# Altium schematic sheet CLOCK.SchDoc: GPS CLOCK
size A4; Date: 2022/9/30; Author: EUCLID; DrawnBy: EUCLID; Revision: @V1.0; SheetNumber: 1; SheetTotal: 1; Time: 11:24
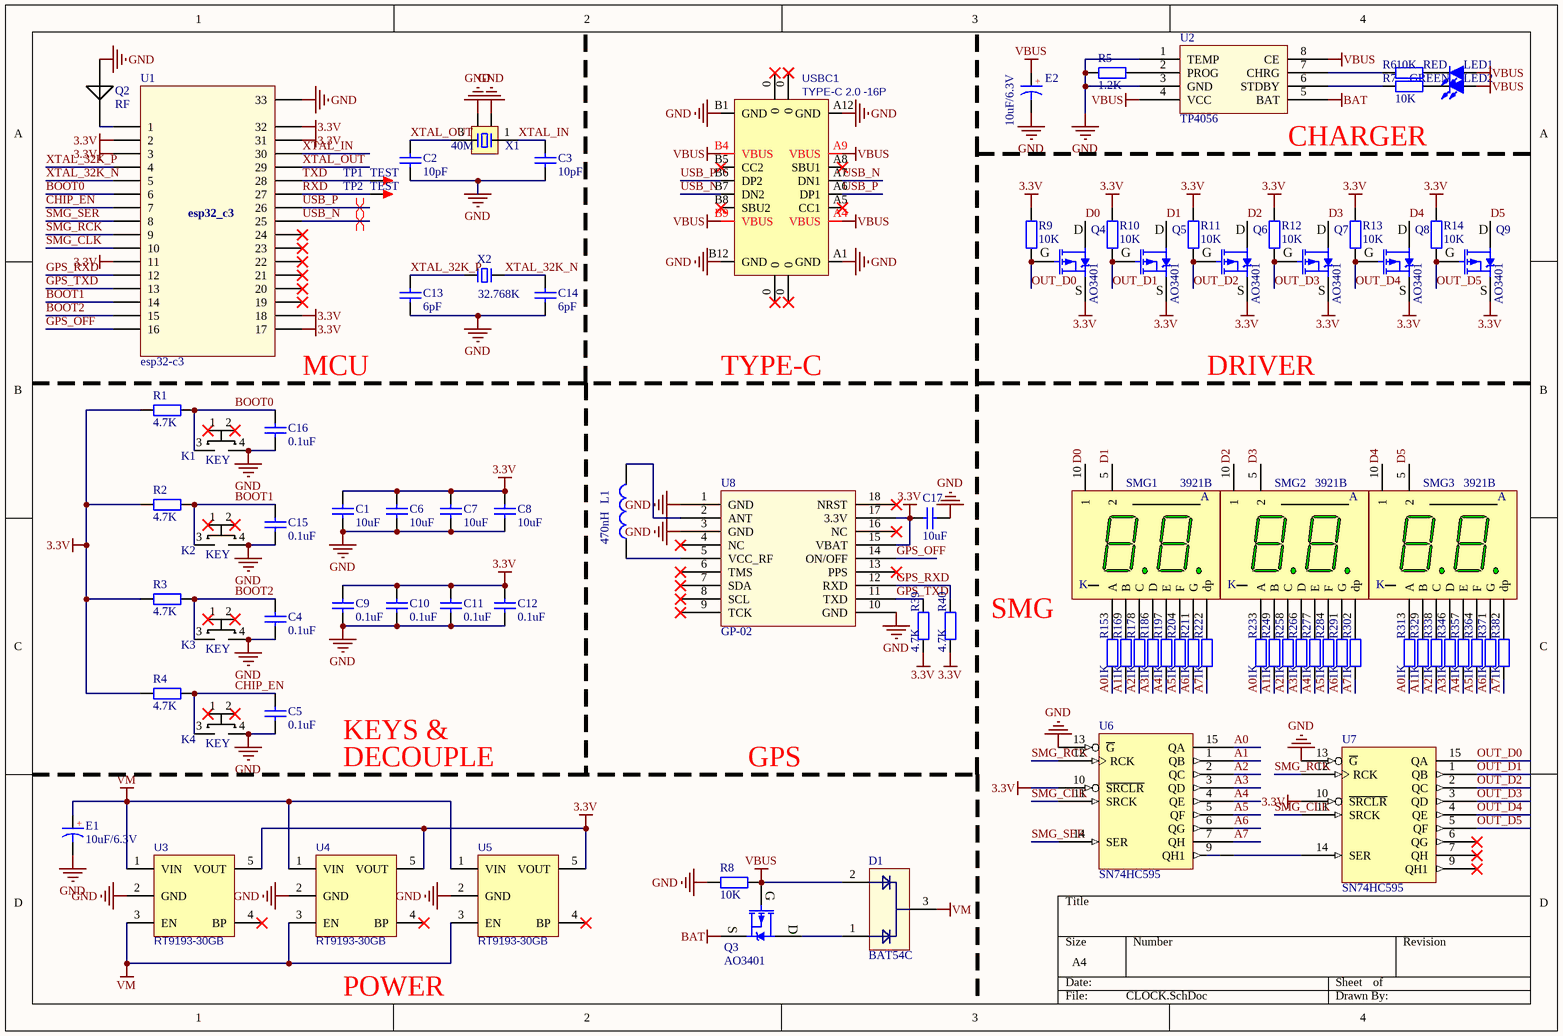
[diagram p0: CLOCK.SchDoc]

## Parts
C1  10uF  [C0603_L]
C2  10pF  [C0603_L]
C3  10pF  [C0603_L]
C4  0.1uF  [C0603_L]
C5  0.1uF  [C0603_L]
C6  10uF  [C0603_L]
C7  10uF  [C0603_L]
C8  10uF  [C0603_L]
C9  0.1uF  [C0603_L]
C10  0.1uF  [C0603_L]
C11  0.1uF  [C0603_L]
C12  0.1uF  [C0603_L]
C13  6pF  [C0603_L]
C14  6pF  [C0603_L]
C15  0.1uF  [C0603_L]
C16  0.1uF  [C0603_L]
C17  10uF  [C0603_L]
D1  BAT54C  [SOT23-3N]
E1  10uF/6.3V  [C_2012]
E2  10uF/6.3V  [C_2012]
K1  KEY  [KEY]
K2  KEY  [KEY]
K3  KEY  [KEY]
K4  KEY  [KEY]
L1  470nH  [L0603]
LED1  RED  [LED0805_G]
LED2  GREEN  [LED0805_G]
Q2  RF  [RF]
Q3  AO3401  [SOT23-3N]
Q4  AO3401  [SOT23-3N]
Q5  AO3401  [SOT23-3N]
Q6  AO3401  [SOT23-3N]
Q7  AO3401  [SOT23-3N]
Q8  AO3401  [SOT23-3N]
Q9  AO3401  [SOT23-3N]
R1  4.7K  [R0603_L]
R2  4.7K  [R0603_L]
R3  4.7K  [R0603_L]
R4  4.7K  [R0603_L]
R5  1.2K  [R0603_L]
R6  10K  [R0603_L]
R7  10K  [R0603_L]
R8  10K  [R0603_L]
R9  10K  [R0603_L]
R10  10K  [R0603_L]
R11  10K  [R0603_L]
R12  10K  [R0603_L]
R13  10K  [R0603_L]
R14  10K  [R0603_L]
R15  1K  [R0603_L]
R16  1K  [R0603_L]
R17  1K  [R0603_L]
R18  1K  [R0603_L]
R19  1K  [R0603_L]
R20  1K  [R0603_L]
R21  1K  [R0603_L]
R22  1K  [R0603_L]
R23  1K  [R0603_L]
R24  1K  [R0603_L]
R25  1K  [R0603_L]
R26  1K  [R0603_L]
R27  1K  [R0603_L]
R28  1K  [R0603_L]
R29  1K  [R0603_L]
R30  1K  [R0603_L]
R31  1K  [R0603_L]
R32  1K  [R0603_L]
R33  1K  [R0603_L]
R34  1K  [R0603_L]
R35  1K  [R0603_L]
R36  1K  [R0603_L]
R37  1K  [R0603_L]
R38  1K  [R0603_L]
R39  4.7K  [R0603_L]
R40  4.7K  [R0603_L]
SMG1  3921B  [GS3922CPG-G]
SMG2  3921B  [GS3922CPG-G]
SMG3  3921B  [GS3922CPG-G]
TP1  TEST  [TEST 1.6]
TP2  TEST  [TEST 1.6]
U1  esp32-c3  [QFN32 5x5_M]
U2  TP4056  [SOP-8]
U3  RT9193-30GB  [SOT-23-5]
U4  RT9193-30GB  [SOT-23-5]
U5  RT9193-30GB  [SOT-23-5]
U6  SN74HC595  [SO16]
U7  SN74HC595  [SO16]
U8  GP-02  [GP-02]
USBC1  TYPE-C 2.0 -16P  [USB-C-SMD_16P]
X1  40M  [XTAL-3225-4P]
X2  32.768K  [XTAL-3x8-WS]

## Nets
3.3V: C1.2 C6.2 C7.2 C8.2 C9.2 C10.2 C11.2 C12.2 C17.2 Q4.2(S) Q5.2(S) Q6.2(S) Q7.2(S) Q8.2(S) Q9.2(S) R1.1 R2.1 R3.1 R4.1 R9.2 R10.2 R11.2 R12.2 R13.2 R14.2 R39.1 R40.1 U1.2 U1.3 U1.11 U1.17 U1.18 U1.31 U1.32 U3.5(VOUT) U4.5(VOUT) U5.5(VOUT) U6.10(~{SRCLR}) U7.10(~{SRCLR}) U8.15(VBAT) U8.17(3.3V)
BAT: Q3.2(S) U2.5(BAT)
GND: C1.1 C2.1 C3.1 C4.1 C5.1 C6.1 C7.1 C8.1 C9.1 C10.1 C11.1 C12.1 C13.1 C14.1 C15.1 C16.1 C17.1 E1.2(K) E2.2(K) K1.4 K2.4 K3.4 K4.4 Q2.1 R5.1 R8.1 U1.33 U2.1(TEMP) U2.3(GND) U3.2(GND) U4.2(GND) U5.2(GND) U6.8(GND) U6.13(~{G}) U7.8(GND) U7.13(~{G}) U8.1(GND) U8.3(GND) U8.10(GND) USBC1.A1(GND) USBC1.A12(GND) USBC1.B1(GND) USBC1.B12(GND) X1.2 X1.4
VBUS: D1.2 E2.1(A) LED1.1(A) LED2.1(A) Q3.1(G) R8.2 U2.4(VCC) U2.8(CE) USBC1.A4(VBUS) USBC1.A9(VBUS) USBC1.B4(VBUS) USBC1.B9(VBUS)
VCC: U6.16(VCC) U7.16(VCC)
VM: D1.3 E1.1(A) U3.1(VIN) U3.3(EN) U4.1(VIN) U4.3(EN) U5.1(VIN) U5.3(EN)
A0: R15.1 R23.1 R31.1 U6.15(QA)
A1: R16.1 R24.1 R32.1 U6.1(QB)
A2: R17.1 R25.1 R33.1 U6.2(QC)
A3: R18.1 R26.1 R34.1 U6.3(QD)
A4: R19.1 R27.1 R35.1 U6.4(QE)
A5: R20.1 R28.1 R36.1 U6.5(QF)
A6: R21.1 R29.1 R37.1 U6.6(QG)
A7: R22.1 R30.1 R38.1 U6.7(QH)
BOOT0: C16.2 K1.3 R1.2 U1.6
BOOT1: C15.2 K2.3 R2.2 U1.14
BOOT2: C4.2 K3.3 R3.2 U1.15
CHIP_EN: C5.2 K4.3 R4.2 U1.7
D0: Q4.3(D) SMG1.10(1)
D1: Q5.3(D) SMG1.5(2)
D2: Q6.3(D) SMG2.10(1)
D3: Q7.3(D) SMG2.5(2)
D4: Q8.3(D) SMG3.10(1)
D5: Q9.3(D) SMG3.5(2)
GPS_OFF: U1.16 U8.14(ON/OFF)
GPS_RXD: R40.2 U1.12 U8.12(RXD)
GPS_TXD: R39.2 U1.13 U8.11(TXD)
OUT_D0: Q4.1(G) R9.1 U7.15(QA)
OUT_D1: Q5.1(G) R10.1 U7.1(QB)
OUT_D2: Q6.1(G) R11.1 U7.2(QC)
OUT_D3: Q7.1(G) R12.1 U7.3(QD)
OUT_D4: Q8.1(G) R13.1 U7.4(QE)
OUT_D5: Q9.1(G) R14.1 U7.5(QF)
RXD: TP2.1 U1.27
SMG_CLK: U1.10 U6.11(SRCK) U7.11(SRCK)
SMG_RCK: U1.9 U6.12(RCK) U7.12(RCK)
SMG_SER: U1.8 U6.14(SER)
TXD: TP1.1 U1.28
USB_N: U1.25 USBC1.A7(DN1) USBC1.B7(DN2)
USB_P: U1.26 USBC1.A6(DP1) USBC1.B6(DP2)
XTAL_32K_N: C14.2 U1.5 X2.2
XTAL_32K_P: C13.2 U1.4 X2.1
XTAL_IN: C3.2 U1.30 X1.1
XTAL_OUT: C2.2 U1.29 X1.3
NetD1_1: D1.1 Q3.3(D)
NetL1_1: L1.1 U8.5(VCC_RF)
NetL1_2: L1.2 U8.2(ANT)
NetLED1_2: LED1.2(K) R6.1
NetLED2_2: LED2.2(K) R7.1
NetQ2_2: Q2.2 U1.1
NetR5_2: R5.2 U2.2(PROG)
NetR6_2: R6.2 U2.7(CHRG)
NetR7_2: R7.2 U2.6(STDBY)
NetR15_2: R15.2 SMG1.3(A)
NetR16_2: R16.2 SMG1.9(B)
NetR17_2: R17.2 SMG1.8(C)
NetR18_2: R18.2 SMG1.6(D)
NetR19_2: R19.2 SMG1.7(E)
NetR20_2: R20.2 SMG1.4(F)
NetR21_2: R21.2 SMG1.1(G)
NetR22_2: R22.2 SMG1.2(dp)
NetR23_2: R23.2 SMG2.3(A)
NetR24_2: R24.2 SMG2.9(B)
NetR25_2: R25.2 SMG2.8(C)
NetR26_2: R26.2 SMG2.6(D)
NetR27_2: R27.2 SMG2.7(E)
NetR28_2: R28.2 SMG2.4(F)
NetR29_2: R29.2 SMG2.1(G)
NetR30_2: R30.2 SMG2.2(dp)
NetR31_2: R31.2 SMG3.3(A)
NetR32_2: R32.2 SMG3.9(B)
NetR33_2: R33.2 SMG3.8(C)
NetR34_2: R34.2 SMG3.6(D)
NetR35_2: R35.2 SMG3.7(E)
NetR36_2: R36.2 SMG3.4(F)
NetR37_2: R37.2 SMG3.1(G)
NetR38_2: R38.2 SMG3.2(dp)
NetU6_9: U6.9(QH1) U7.14(SER)

Not connected (* = marked no-connect by the designer): K1 1* 2*; K2 1* 2*; K3 1* 2*; K4 1* 2*; U1 19* 20* 21* 22* 23* 24*; U3 4(BP)*; U4 4(BP)*; U5 4(BP)*; U7 6(QG)* 7(QH)* 9(QH1)*; U8 4(NC)* 6(TMS)* 7(SDA)* 8(SCL)* 9(TCK)* 13(PPS)* 16(NC)* 18(NRST)*; USBC1 0* A5(CC1)* A8(SBU1)* B5(CC2)* B8(SBU2)*

## Layout directives
differential pair: USB_N, USB_P

## Notes on the sheet
- CHARGER
- MCU
- TYPE-C
- DRIVER
- SMG
- DECOUPLE
- KEYS &
- GPS
- (near U4) POWER
- (in symbol 3921B) K
- (in symbol CT) +
- (in symbol esp32-c3) esp32_c3

## Library data of the parts
C1-C17 = C: 贴片电容/MLCC电容; BOM名称: 无极性贴片电容; 联系卖家，免费查找封装: 唯一出售店铺网址https://shop463601444.taobao.com
D1 = BAT54C: 两路肖特基二极管; 以赠品形式获赠本封装库的买家，还可联系卖家免费指导AD软件使用: 封装库来自淘宝卖家ID：黄晶宝石
E1 E2 = CT: 贴片钽电容; 联系卖家，免费查找封装: 唯一出售店铺网址https://shop463601444.taobao.com; BOM名称: 贴片钽电容
L1 = L: 贴片小功率电感; BOM名称: 小功率贴片电感; 联系卖家，免费查找封装: 唯一出售店铺网址https://shop463601444.taobao.com
LED1 LED2 = LED-SMD: 贴片LED; 封装库来自淘宝卖家ID：黄晶宝石: 其他店铺购入均为盗版封装库，请立即申请退款，本店现金奖励20~200元; BOM名称: 贴片LED
Q3-Q9 = AO3401: P沟道 30V/4.2A; BOM名称: 场效应管; 8元以下特价购入的买家: 还可以联系卖家远程指导AD软件使用; 参数: P沟道 30V/4.2A
R1-R40 = R: 贴片电阻; 联系卖家，免费查找封装: 唯一出售店铺网址https://shop463601444.taobao.com; BOM名称: 贴片电阻
SMG1-SMG3 = 3921B: 0.39寸2位共阳数码管; 联系卖家 免费技术支持: 唯一出售店铺网址https://shop463601444.taobao.com; BOM名称: 0.39寸2位共阳
TP1 TP2 = TEST: 测试点; 联系卖家，免费查找封装: 唯一出售店铺网址https://shop463601444.taobao.com; 封装库来自淘宝卖家ID：黄晶宝石: 其他店铺购入的，请立即申请退款，本店现金奖励20~500元; BOM名称: 测试点
U3-U5 = RT9193-30GB: LDO 3.0V/0.3A; 芯片厂商: RICHTEK; 封装库来自淘宝卖家ID：黄晶宝石: 其他店铺购入的买家，请立即申请退款，本店现金奖励20~1000元; BOM名称: RT9193-30GB
U6 U7 = SN74HC595: 8-BIT SFT REG WIRTH OUTPUT LCH; 技术支持，联系售后: 唯一出售店铺网址https://shop463601444.taobao.com
USBC1 = USB2.0_Type-C_16Pin: USB2.0_Type-C_16Pin母座; 联系卖家 免费技术支持: 封装库来自淘宝卖家ID：黄晶宝石
X1 = XTAL-4P: 4脚无源晶振(谐振器）; 联系卖家，免费查找封装: 唯一出售店铺网址https://shop463601444.taobao.com; BOM名称: 4脚无源晶振(谐振器）
X2 = XTAL-2P: 2脚无源晶振(谐振器）; 联系卖家，免费查找封装: 唯一出售店铺网址https://shop463601444.taobao.com; BOM名称: 2脚无源晶振(谐振器）